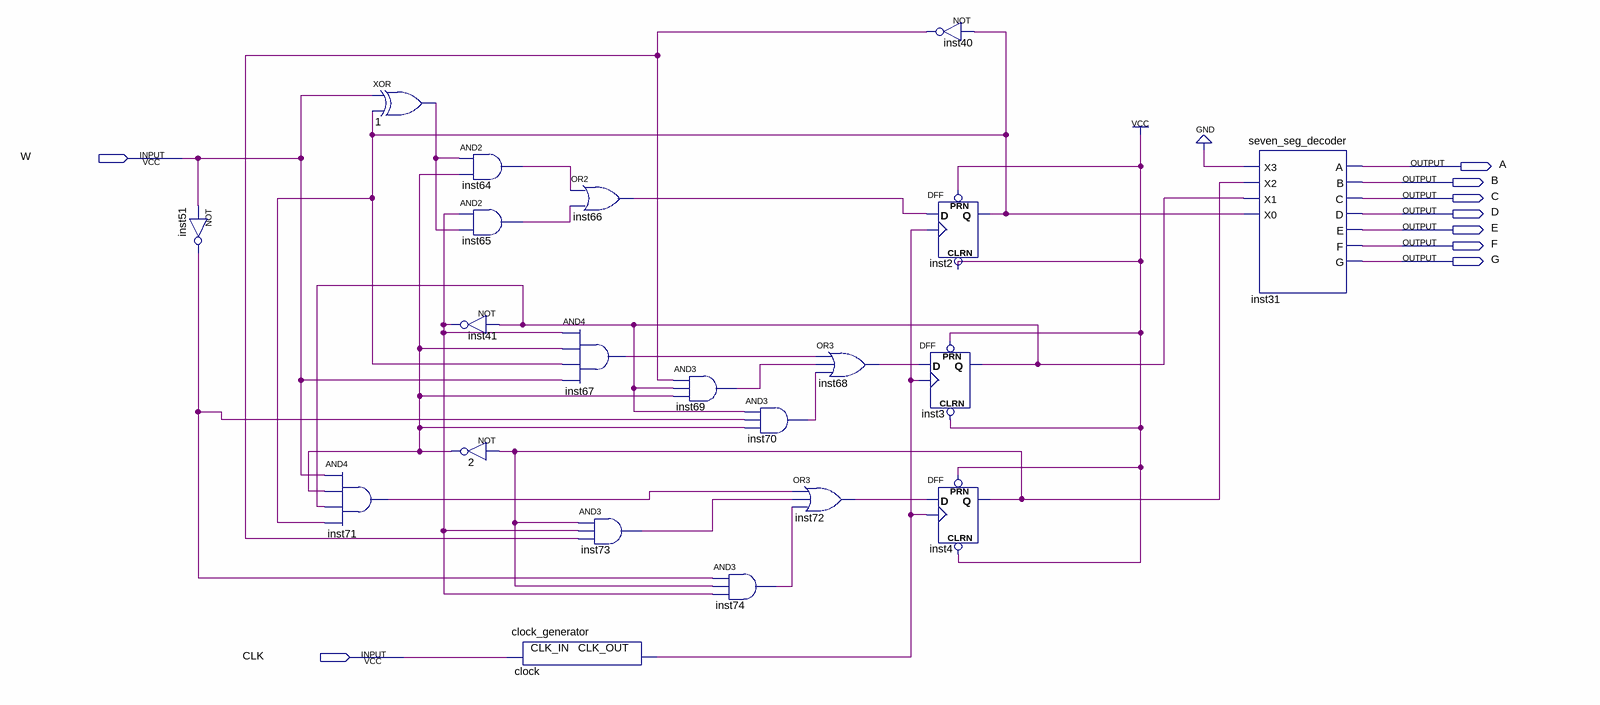
[diagram p0: schematic sheet]
// Quartus schematic lab11step1.bdf as structural Verilog: 21 symbols, 9 pins
module lab11step1 (
  input  W,
  input  CLK,
  output A,
  output B,
  output C,
  output D,
  output E,
  output F,
  output G
);

  wire clock_clk_out, inst2_q, inst3_q, inst4_q, inst40_out, inst41_out, inst51_out, inst64_out, inst65_out,
       inst66_out, inst67_out, inst68_out, inst69_out, inst70_out, inst71_out, inst72_out, inst73_out,
       inst74_out, n1_out, n2_out;

  not inst51 (inst51_out, W);
  and inst71 (inst71_out, W, n2_out, inst3_q, inst2_q);
  xor u_1 (n1_out, W, inst2_q);
  and inst64 (inst64_out, n1_out, n2_out);
  and inst65 (inst65_out, inst41_out, n1_out);
  not inst41 (inst41_out, inst3_q);
  not u_2 (n2_out, inst4_q);
  clock_generator clock (.CLK_IN(CLK), .CLK_OUT(clock_clk_out));
  or inst66 (inst66_out, inst64_out, inst65_out);
  and inst67 (inst67_out, inst41_out, n2_out, inst2_q, W);
  and inst73 (inst73_out, inst4_q, inst41_out, inst40_out);
  and inst69 (inst69_out, inst40_out, inst3_q, n2_out);
  and inst74 (inst74_out, inst51_out, inst4_q, inst41_out);
  and inst70 (inst70_out, inst3_q, inst51_out, n2_out);
  or inst72 (inst72_out, inst71_out, inst73_out, inst74_out);
  or inst68 (inst68_out, inst67_out, inst69_out, inst70_out);
  DFF inst3 (.CLRN(1'b1), .CLK(clock_clk_out), .D(inst68_out), .PRN(1'b1), .Q(inst3_q));
  not inst40 (inst40_out, inst2_q);
  DFF inst2 (.CLRN(1'b1), .CLK(clock_clk_out), .D(inst66_out), .PRN(1'b1), .Q(inst2_q));
  DFF inst4 (.CLRN(1'b1), .CLK(clock_clk_out), .D(inst72_out), .PRN(1'b1), .Q(inst4_q));
  seven_seg_decoder inst31 (
    .X3(1'b0), .X2(inst4_q), .X1(inst3_q), .X0(inst2_q), .A(A), .B(B), .C(C), .D(D), .E(E), .F(F), .G(G));
endmodule
